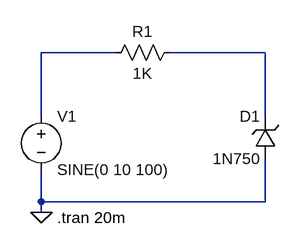
[diagram p0: schematic Practica 3-2.asc]
Practica 3-2.asc, the LTspice schematic file:
Version 4
SHEET 1 880 680
WIRE 144 -16 32 -16
WIRE 368 -16 224 -16
WIRE 32 80 32 -16
WIRE 368 80 368 -16
WIRE 32 208 32 160
WIRE 368 208 368 144
WIRE 368 208 32 208
WIRE 32 224 32 208
FLAG 32 224 0
SYMBOL voltage 32 64 R0
WINDOW 123 0 0 Left 0
WINDOW 39 0 0 Left 0
SYMATTR InstName V1
SYMATTR Value SINE(0 10 100)
SYMBOL res 240 -32 R90
WINDOW 0 0 56 VBottom 2
WINDOW 3 32 56 VTop 2
SYMATTR InstName R1
SYMATTR Value 1K
SYMBOL zener 384 144 R180
WINDOW 0 24 64 Left 2
WINDOW 3 24 0 Left 2
SYMATTR InstName D1
SYMATTR Value 1N750
TEXT 56 232 Left 2 !.tran 20m

The netlist it stands for:
* Practica 3-2.asc
V1 N001 0 SINE(0 10 100)
R1 N002 N001 1K
D1 0 N002 1N750
.model D D
.lib standard.dio
.tran 20m
.backanno
.end